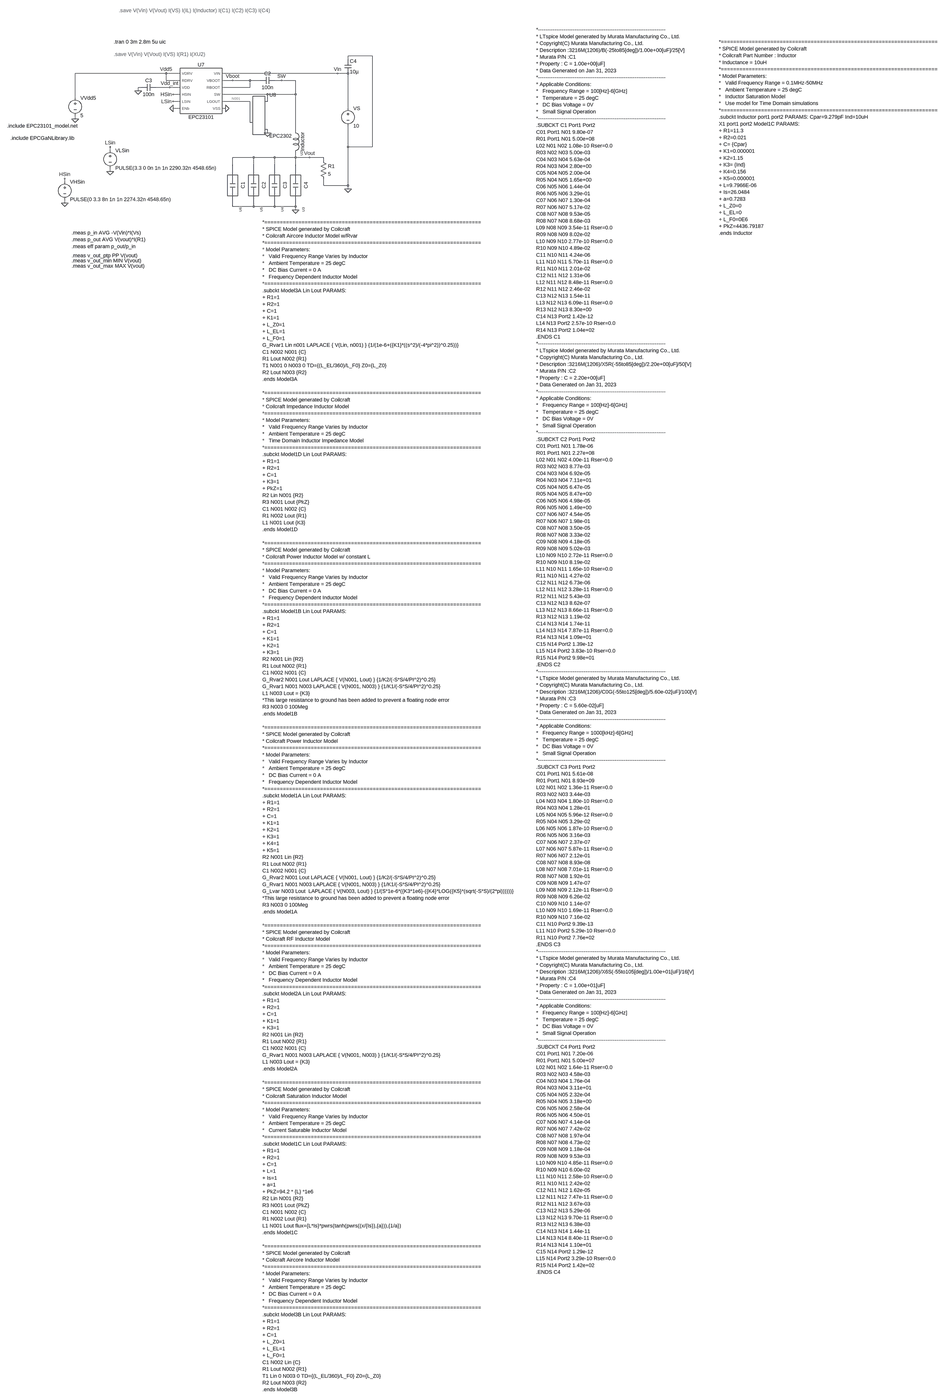
[diagram p0: schematic EPC23101_With_Schottky.asc, whole sheet]
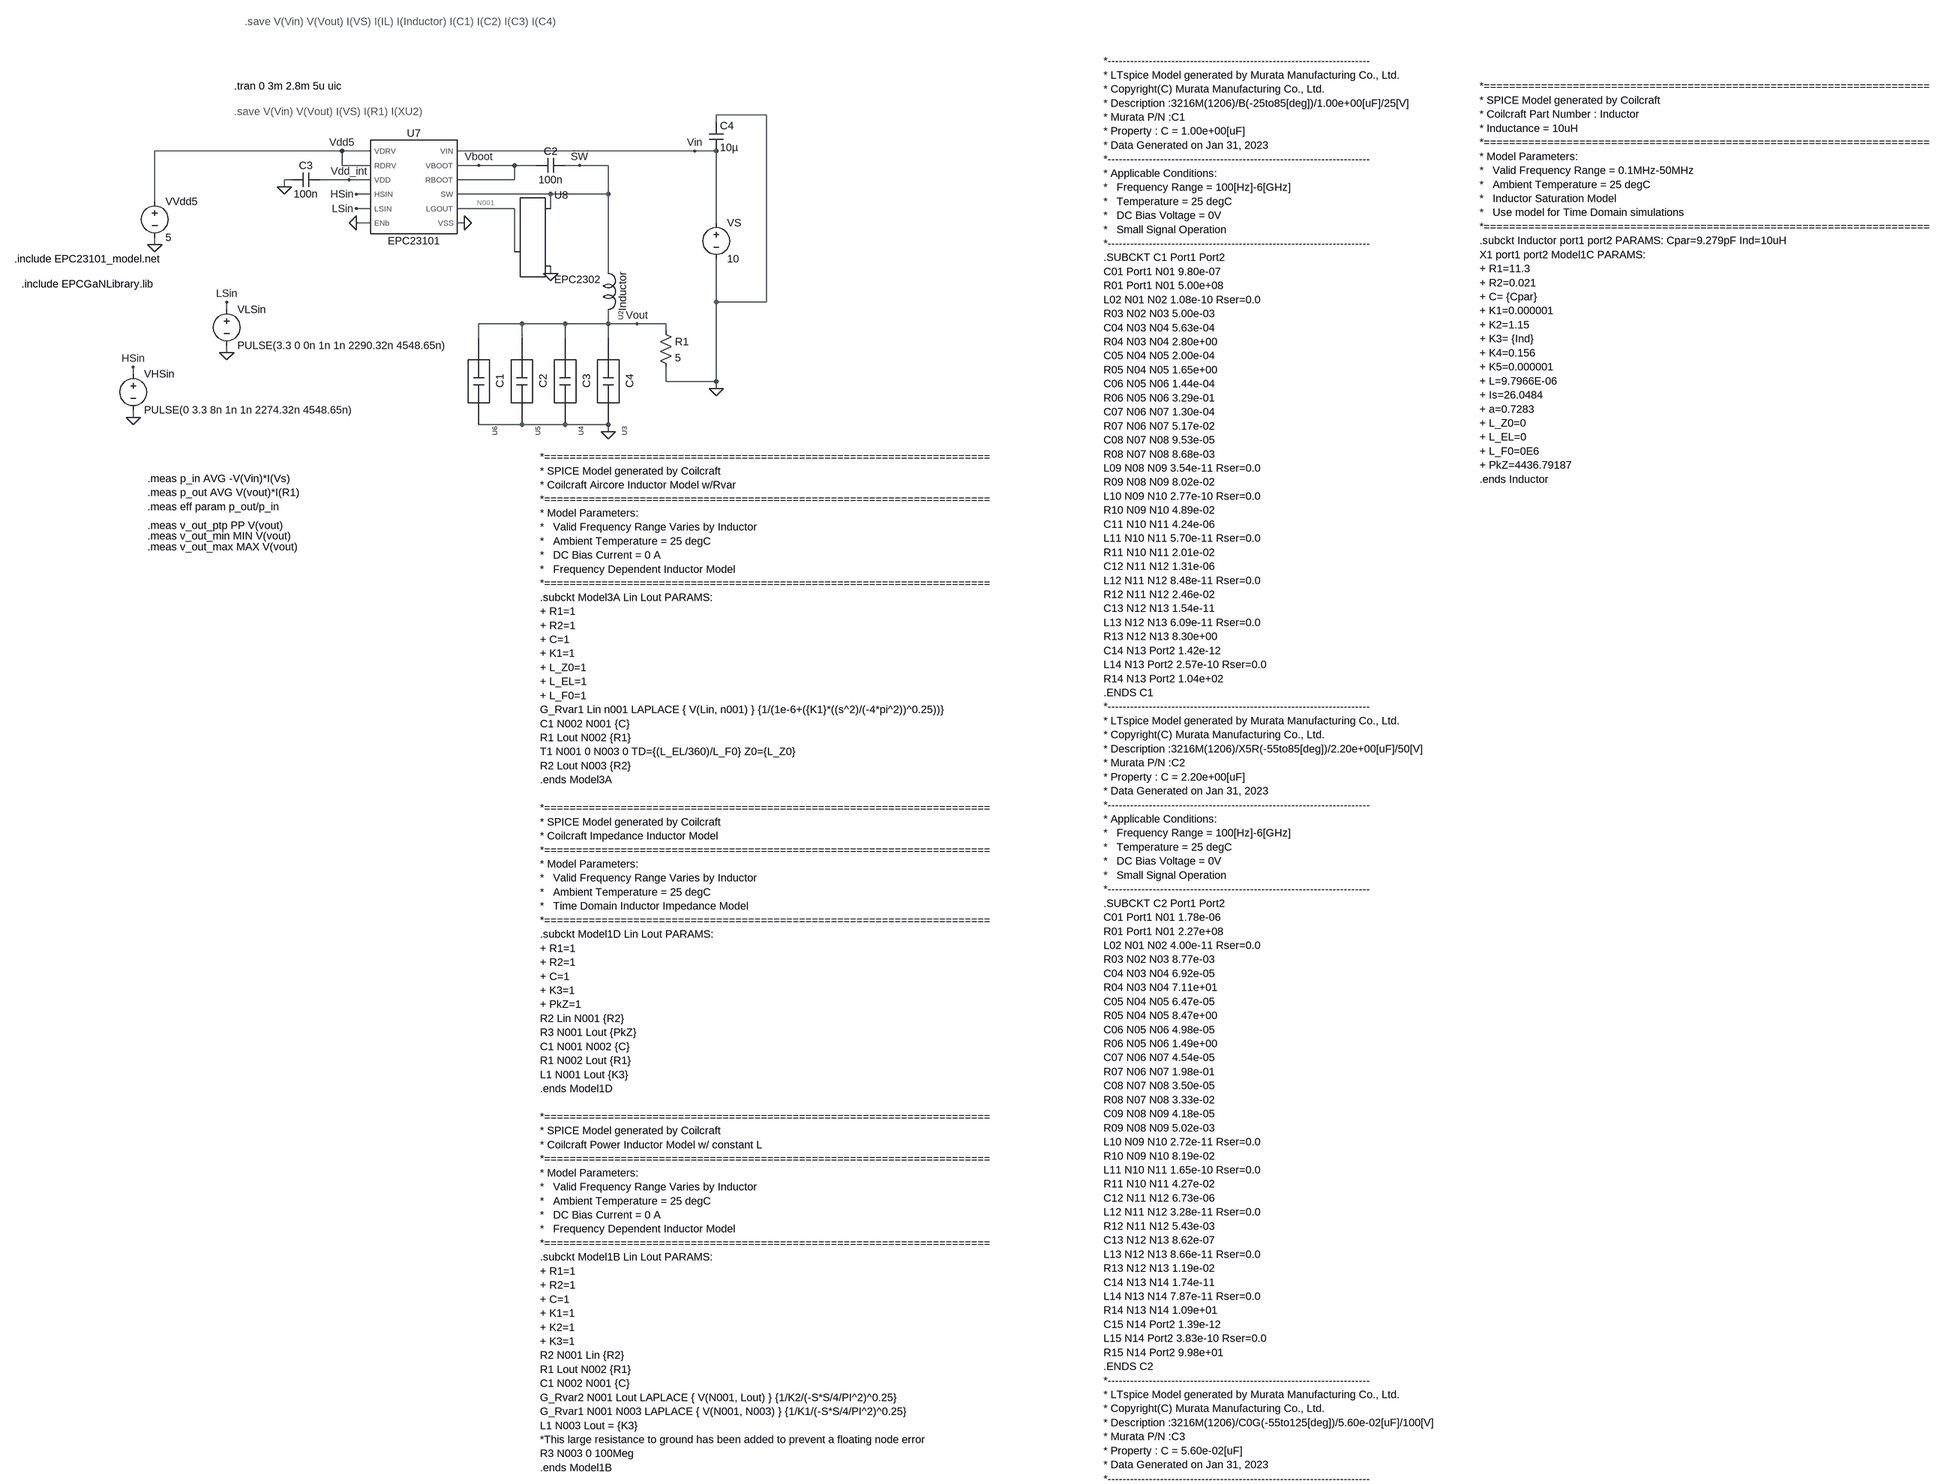
[diagram p1: schematic EPC23101_With_Schottky.asc, part, row 1 of 2, column 1 of 1]
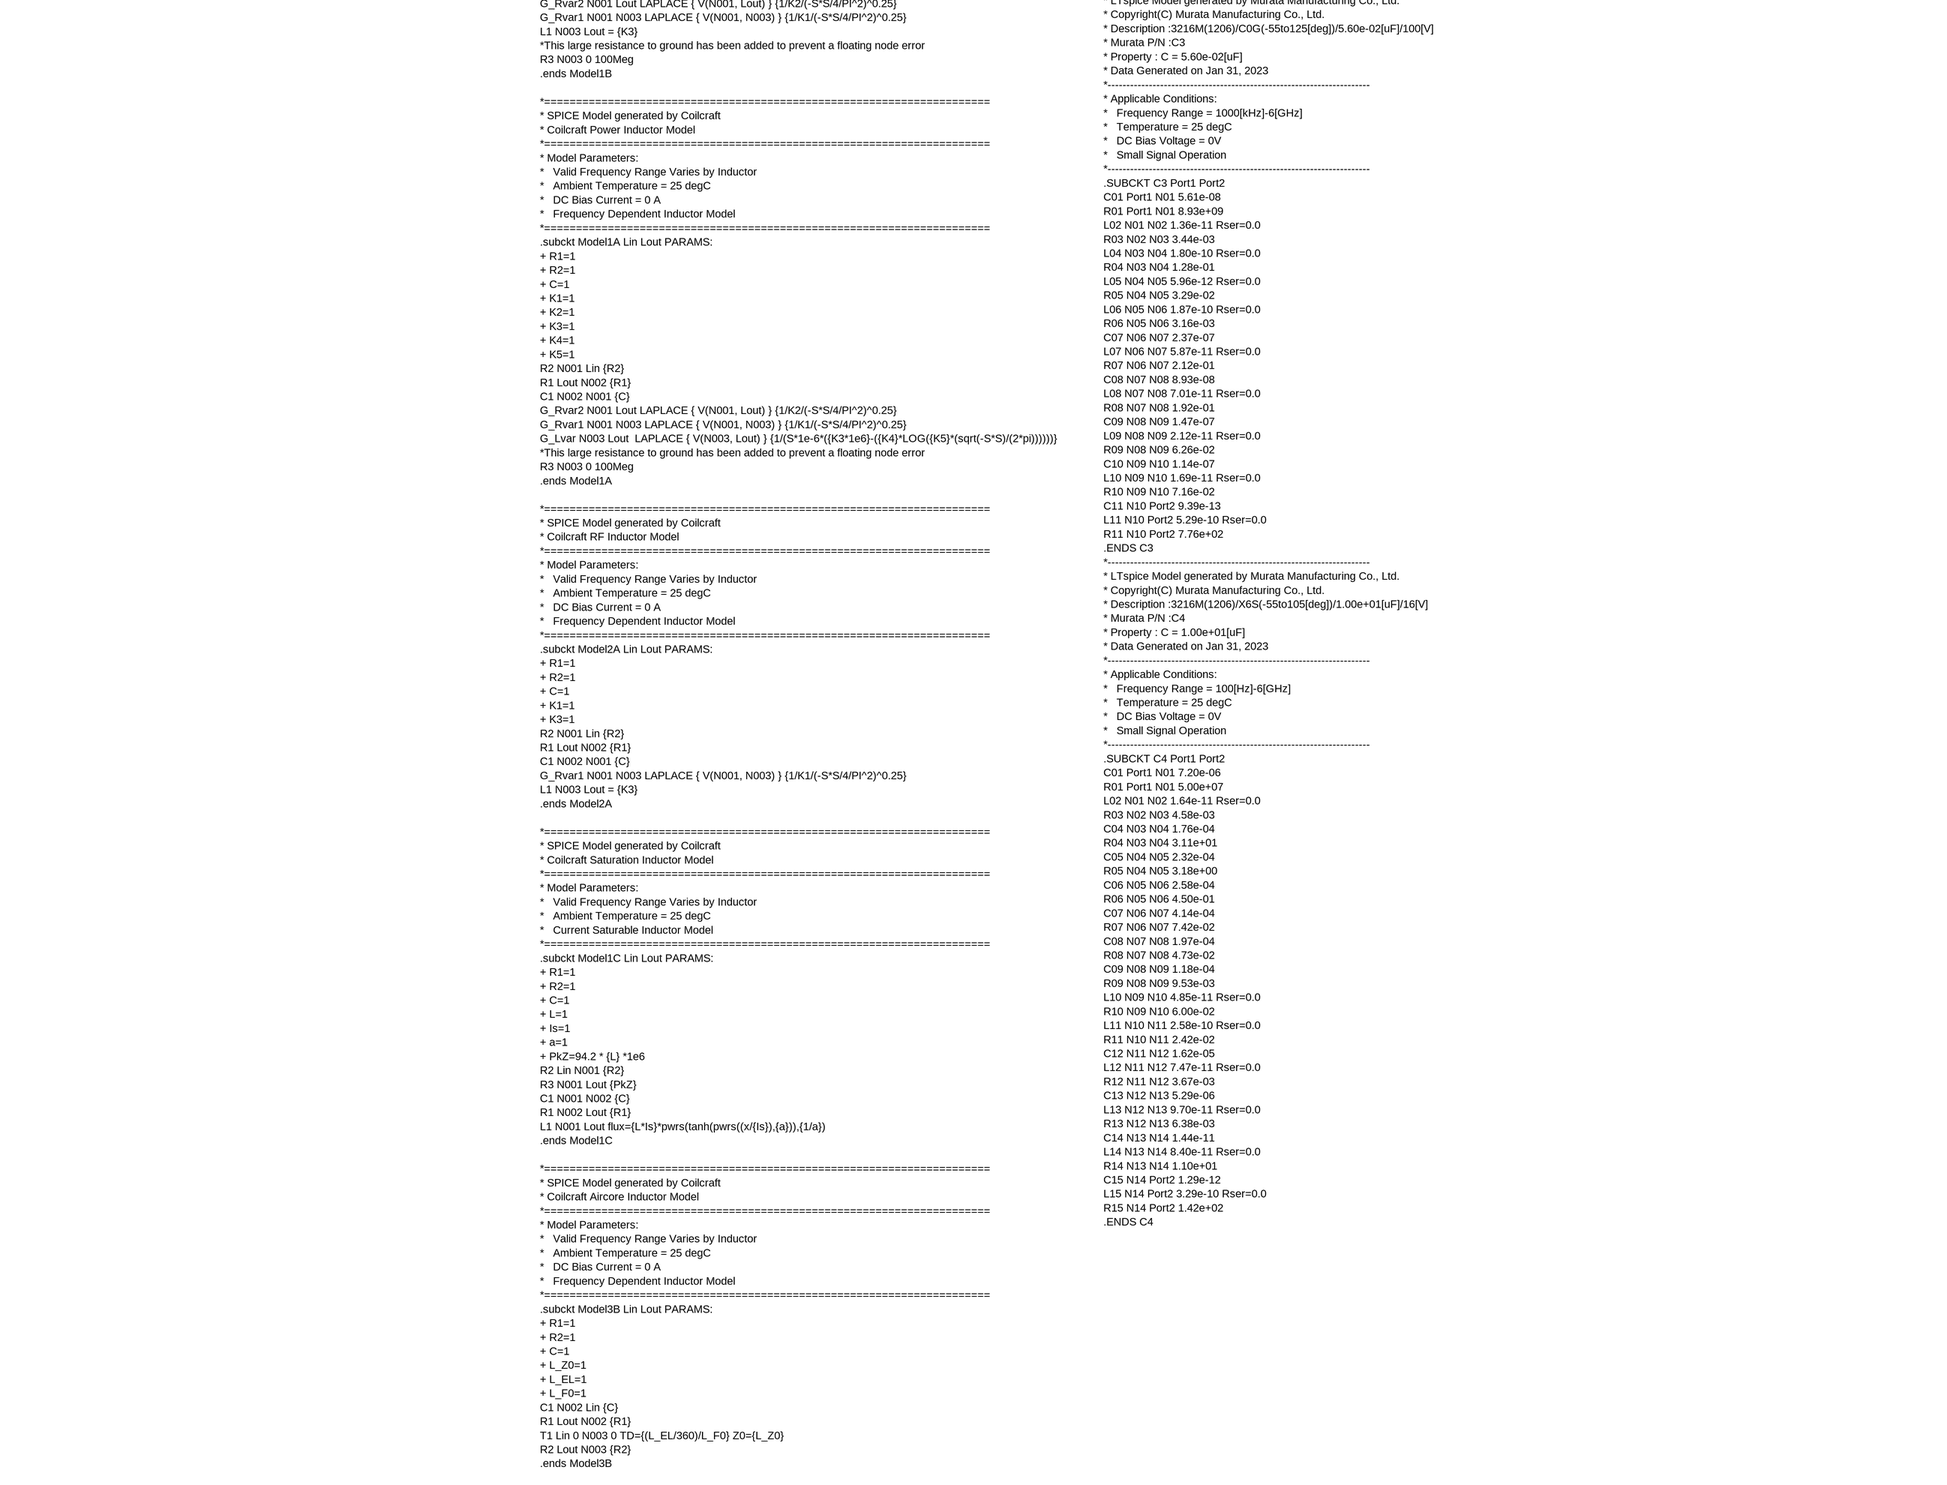
[diagram p2: schematic EPC23101_With_Schottky.asc, part, row 2 of 2, column 1 of 1]
EPC23101_With_Schottky.asc, the LTspice schematic file:
Version 4
SHEET 1 4884 5596
WIRE 1696 -208 1584 -208
WIRE 1584 -192 1584 -208
WIRE 752 -128 336 -128
WIRE 816 -128 752 -128
WIRE 1536 -128 1008 -128
WIRE 1584 -128 1536 -128
WIRE 752 -96 752 -128
WIRE 816 -96 752 -96
WIRE 1056 -96 1008 -96
WIRE 1136 -96 1056 -96
WIRE 1184 -96 1136 -96
WIRE 1280 -96 1248 -96
WIRE 1344 -96 1280 -96
WIRE 640 -64 624 -64
WIRE 768 -64 704 -64
WIRE 816 -64 768 -64
WIRE 1136 -64 1136 -96
WIRE 1136 -64 1008 -64
WIRE 624 -48 624 -64
WIRE 816 -32 784 -32
WIRE 1216 -32 1008 -32
WIRE 1344 -32 1344 -96
WIRE 1344 -32 1216 -32
WIRE 336 -16 336 -128
WIRE 816 0 784 0
WIRE 1136 0 1008 0
WIRE 1216 0 1216 -32
WIRE 816 32 784 32
WIRE 1024 32 1008 32
WIRE 1584 32 1584 -128
WIRE 336 80 336 64
WIRE 1136 96 1136 0
WIRE 1216 144 1216 128
WIRE 1344 144 1344 -32
WIRE 1584 208 1584 112
WIRE 1696 208 1696 -208
WIRE 1696 208 1584 208
WIRE 496 224 496 208
WIRE 1152 256 1056 256
WIRE 1248 256 1152 256
WIRE 1344 256 1344 224
WIRE 1344 256 1248 256
WIRE 1408 256 1344 256
WIRE 1472 256 1408 256
WIRE 1472 272 1472 256
WIRE 1056 288 1056 256
WIRE 1152 288 1152 256
WIRE 1248 288 1248 256
WIRE 1344 288 1344 256
WIRE 496 320 496 304
WIRE 288 368 288 352
WIRE 1472 384 1472 352
WIRE 1584 384 1584 208
WIRE 1584 384 1472 384
WIRE 1584 400 1584 384
WIRE 288 464 288 448
WIRE 1152 480 1056 480
WIRE 1248 480 1152 480
WIRE 1344 480 1248 480
WIRE 1344 496 1344 480
FLAG 1408 256 Vout
FLAG 784 -32 HSin
FLAG 784 0 LSin
FLAG 752 -128 Vdd5
FLAG 1536 -128 Vin
FLAG 1056 -96 Vboot
FLAG 1280 -96 SW
FLAG 768 -64 Vdd_int
FLAG 1024 32 0
FLAG 784 32 0
FLAG 496 208 LSin
FLAG 496 320 0
FLAG 288 352 HSin
FLAG 288 464 0
FLAG 1584 400 0
FLAG 624 -48 0
FLAG 336 80 0
FLAG 1344 496 0
FLAG 1216 144 0
SYMBOL voltage 288 352 R0
WINDOW 123 0 0 Left 0
WINDOW 39 0 0 Left 0
SYMATTR InstName VHSin
SYMATTR Value PULSE(0 3.3 8n 1n 1n 2274.32n 4548.65n)
SYMBOL voltage 496 208 R0
WINDOW 123 0 0 Left 0
WINDOW 39 0 0 Left 0
SYMATTR InstName VLSin
SYMATTR Value PULSE(3.3 0 0n 1n 1n 2290.32n 4548.65n)
SYMBOL cap 1248 -112 R90
WINDOW 0 0 32 VBottom 2
WINDOW 3 32 32 VTop 2
SYMATTR InstName C2
SYMATTR Value 100n
SYMBOL voltage 336 -32 R0
WINDOW 123 0 0 Left 0
WINDOW 39 0 0 Left 0
SYMATTR InstName VVdd5
SYMATTR Value 5
SYMBOL voltage 1584 16 R0
WINDOW 123 0 0 Left 0
WINDOW 39 0 0 Left 0
SYMATTR InstName VS
SYMATTR Value 10
SYMBOL cap 704 -80 R90
WINDOW 0 0 32 VBottom 2
WINDOW 3 32 32 VTop 2
SYMATTR InstName C3
SYMATTR Value 100n
SYMBOL cap 1568 -192 R0
SYMATTR InstName C4
SYMATTR Value 10µ
SYMBOL XAL1010_Mine 1344 144 R90
SYMATTR SpiceModel Inductor
SYMATTR InstName U2
SYMBOL GRM_Mine 1344 384 R90
SYMATTR SpiceModel C4
SYMATTR InstName U3
SYMBOL GRM_Mine 1248 384 R90
SYMATTR SpiceModel C3
SYMATTR InstName U4
SYMBOL GRM_Mine 1152 384 R90
SYMATTR SpiceModel C2
SYMATTR InstName U5
SYMBOL GRM_Mine 1056 384 R90
SYMATTR SpiceModel C1
SYMATTR InstName U6
SYMBOL res 1456 256 R0
SYMATTR InstName R1
SYMATTR Value 5
SYMBOL EPC23101_model 912 -48 R0
SYMATTR InstName U7
SYMBOL EPCGaN 1136 96 R0
SYMATTR InstName U8
SYMATTR Value EPC2302
TEXT 512 -272 Left 2 !.tran 0 3m 2.8m 5u uic
TEXT 512 -216 Left 2 ;.save V(Vin) V(Vout) I(VS) I(R1) I(XU2)
TEXT 1192 552 Left 2 !*======================================================================\n* SPICE Model generated by Coilcraft\n* Coilcraft Aircore Inductor Model w/Rvar\n*======================================================================\n* Model Parameters:\n*   Valid Frequency Range Varies by Inductor\n*   Ambient Temperature = 25 degC\n*   DC Bias Current = 0 A\n*   Frequency Dependent Inductor Model\n*======================================================================\n.subckt Model3A Lin Lout PARAMS:\n+ R1=1\n+ R2=1\n+ C=1\n+ K1=1\n+ L_Z0=1\n+ L_EL=1\n+ L_F0=1\nG_Rvar1 Lin n001 LAPLACE { V(Lin, n001) } {1/(1e-6+({K1}*((s^2)/(-4*pi^2))^0.25))}\nC1 N002 N001 {C}\nR1 Lout N002 {R1}\nT1 N001 0 N003 0 TD={(L_EL/360)/L_F0} Z0={L_Z0}\nR2 Lout N003 {R2}\n.ends Model3A\n \n*======================================================================\n* SPICE Model generated by Coilcraft\n* Coilcraft Impedance Inductor Model\n*======================================================================\n* Model Parameters:\n*   Valid Frequency Range Varies by Inductor\n*   Ambient Temperature = 25 degC\n*   Time Domain Inductor Impedance Model\n*======================================================================\n.subckt Model1D Lin Lout PARAMS:\n+ R1=1\n+ R2=1\n+ C=1\n+ K3=1\n+ PkZ=1\nR2 Lin N001 {R2}\nR3 N001 Lout {PkZ}\nC1 N001 N002 {C}\nR1 N002 Lout {R1}\nL1 N001 Lout {K3}\n.ends Model1D\n \n*======================================================================\n* SPICE Model generated by Coilcraft\n* Coilcraft Power Inductor Model w/ constant L\n*======================================================================\n* Model Parameters:\n*   Valid Frequency Range Varies by Inductor\n*   Ambient Temperature = 25 degC\n*   DC Bias Current = 0 A\n*   Frequency Dependent Inductor Model\n*======================================================================\n.subckt Model1B Lin Lout PARAMS:\n+ R1=1\n+ R2=1\n+ C=1\n+ K1=1\n+ K2=1\n+ K3=1\nR2 N001 Lin {R2}\nR1 Lout N002 {R1}\nC1 N002 N001 {C}\nG_Rvar2 N001 Lout LAPLACE { V(N001, Lout) } {1/K2/(-S*S/4/PI^2)^0.25}\nG_Rvar1 N001 N003 LAPLACE { V(N001, N003) } {1/K1/(-S*S/4/PI^2)^0.25}\nL1 N003 Lout = {K3}\n*This large resistance to ground has been added to prevent a floating node error\nR3 N003 0 100Meg\n.ends Model1B\n \n*======================================================================\n* SPICE Model generated by Coilcraft\n* Coilcraft Power Inductor Model\n*======================================================================\n* Model Parameters:\n*   Valid Frequency Range Varies by Inductor\n*   Ambient Temperature = 25 degC\n*   DC Bias Current = 0 A\n*   Frequency Dependent Inductor Model\n*======================================================================\n.subckt Model1A Lin Lout PARAMS:\n+ R1=1\n+ R2=1\n+ C=1\n+ K1=1\n+ K2=1\n+ K3=1\n+ K4=1\n+ K5=1\nR2 N001 Lin {R2}\nR1 Lout N002 {R1}\nC1 N002 N001 {C}\nG_Rvar2 N001 Lout LAPLACE { V(N001, Lout) } {1/K2/(-S*S/4/PI^2)^0.25}\nG_Rvar1 N001 N003 LAPLACE { V(N001, N003) } {1/K1/(-S*S/4/PI^2)^0.25}\nG_Lvar N003 Lout  LAPLACE { V(N003, Lout) } {1/(S*1e-6*({K3*1e6}-({K4}*LOG({K5}*(sqrt(-S*S)/(2*pi))))))}\n*This large resistance to ground has been added to prevent a floating node error\nR3 N003 0 100Meg\n.ends Model1A\n \n*======================================================================\n* SPICE Model generated by Coilcraft\n* Coilcraft RF Inductor Model\n*======================================================================\n* Model Parameters:\n*   Valid Frequency Range Varies by Inductor\n*   Ambient Temperature = 25 degC\n*   DC Bias Current = 0 A\n*   Frequency Dependent Inductor Model\n*======================================================================\n.subckt Model2A Lin Lout PARAMS:\n+ R1=1\n+ R2=1\n+ C=1\n+ K1=1\n+ K3=1\nR2 N001 Lin {R2}\nR1 Lout N002 {R1}\nC1 N002 N001 {C}\nG_Rvar1 N001 N003 LAPLACE { V(N001, N003) } {1/K1/(-S*S/4/PI^2)^0.25}\nL1 N003 Lout = {K3}\n.ends Model2A\n \n*======================================================================\n* SPICE Model generated by Coilcraft\n* Coilcraft Saturation Inductor Model\n*======================================================================\n* Model Parameters:\n*   Valid Frequency Range Varies by Inductor\n*   Ambient Temperature = 25 degC\n*   Current Saturable Inductor Model\n*======================================================================\n.subckt Model1C Lin Lout PARAMS:\n+ R1=1\n+ R2=1\n+ C=1\n+ L=1\n+ Is=1\n+ a=1\n+ PkZ=94.2 * {L} *1e6\nR2 Lin N001 {R2}\nR3 N001 Lout {PkZ}\nC1 N001 N002 {C}\nR1 N002 Lout {R1}\nL1 N001 Lout flux={L*Is}*pwrs(tanh(pwrs((x/{Is}),{a})),{1/a})\n.ends Model1C\n \n*======================================================================\n* SPICE Model generated by Coilcraft\n* Coilcraft Aircore Inductor Model\n*======================================================================\n* Model Parameters:\n*   Valid Frequency Range Varies by Inductor\n*   Ambient Temperature = 25 degC\n*   DC Bias Current = 0 A\n*   Frequency Dependent Inductor Model\n*======================================================================\n.subckt Model3B Lin Lout PARAMS:\n+ R1=1\n+ R2=1\n+ C=1\n+ L_Z0=1\n+ L_EL=1\n+ L_F0=1\nC1 N002 Lin {C}\nR1 Lout N002 {R1}\nT1 Lin 0 N003 0 TD={(L_EL/360)/L_F0} Z0={L_Z0}\nR2 Lout N003 {R2}\n.ends Model3B
TEXT 536 -416 Left 2 ;.save V(Vin) V(Vout) I(VS) I(IL) I(Inductor) I(C1) I(C2) I(C3) I(C4)
TEXT 320 600 Left 2 !.meas p_in AVG -V(Vin)*I(Vs)\n.meas p_out AVG V(vout)*I(R1)\n.meas eff param p_out/p_in
TEXT 320 704 Left 2 !.meas v_out_ptp PP V(vout)
TEXT 320 728 Left 2 !.meas v_out_min MIN V(vout)
TEXT 320 752 Left 2 !.meas v_out_max MAX V(vout)
TEXT 2560 -328 Left 2 !*----------------------------------------------------------------------\n* LTspice Model generated by Murata Manufacturing Co., Ltd.\n* Copyright(C) Murata Manufacturing Co., Ltd.\n* Description :3216M(1206)/B(-25to85[deg])/1.00e+00[uF]/25[V]\n* Murata P/N :C1\n* Property : C = 1.00e+00[uF]\n* Data Generated on Jan 31, 2023\n*----------------------------------------------------------------------\n* Applicable Conditions:\n*   Frequency Range = 100[Hz]-6[GHz]\n*   Temperature = 25 degC\n*   DC Bias Voltage = 0V\n*   Small Signal Operation\n*----------------------------------------------------------------------\n.SUBCKT C1 Port1 Port2\nC01 Port1 N01 9.80e-07\nR01 Port1 N01 5.00e+08\nL02 N01 N02 1.08e-10 Rser=0.0\nR03 N02 N03 5.00e-03\nC04 N03 N04 5.63e-04\nR04 N03 N04 2.80e+00\nC05 N04 N05 2.00e-04\nR05 N04 N05 1.65e+00\nC06 N05 N06 1.44e-04\nR06 N05 N06 3.29e-01\nC07 N06 N07 1.30e-04\nR07 N06 N07 5.17e-02\nC08 N07 N08 9.53e-05\nR08 N07 N08 8.68e-03\nL09 N08 N09 3.54e-11 Rser=0.0\nR09 N08 N09 8.02e-02\nL10 N09 N10 2.77e-10 Rser=0.0\nR10 N09 N10 4.89e-02\nC11 N10 N11 4.24e-06\nL11 N10 N11 5.70e-11 Rser=0.0\nR11 N10 N11 2.01e-02\nC12 N11 N12 1.31e-06\nL12 N11 N12 8.48e-11 Rser=0.0\nR12 N11 N12 2.46e-02\nC13 N12 N13 1.54e-11\nL13 N12 N13 6.09e-11 Rser=0.0\nR13 N12 N13 8.30e+00\nC14 N13 Port2 1.42e-12\nL14 N13 Port2 2.57e-10 Rser=0.0\nR14 N13 Port2 1.04e+02\n.ENDS C1\n*----------------------------------------------------------------------\n* LTspice Model generated by Murata Manufacturing Co., Ltd.\n* Copyright(C) Murata Manufacturing Co., Ltd.\n* Description :3216M(1206)/X5R(-55to85[deg])/2.20e+00[uF]/50[V]\n* Murata P/N :C2\n* Property : C = 2.20e+00[uF]\n* Data Generated on Jan 31, 2023\n*----------------------------------------------------------------------\n* Applicable Conditions:\n*   Frequency Range = 100[Hz]-6[GHz]\n*   Temperature = 25 degC\n*   DC Bias Voltage = 0V\n*   Small Signal Operation\n*----------------------------------------------------------------------\n.SUBCKT C2 Port1 Port2\nC01 Port1 N01 1.78e-06\nR01 Port1 N01 2.27e+08\nL02 N01 N02 4.00e-11 Rser=0.0\nR03 N02 N03 8.77e-03\nC04 N03 N04 6.92e-05\nR04 N03 N04 7.11e+01\nC05 N04 N05 6.47e-05\nR05 N04 N05 8.47e+00\nC06 N05 N06 4.98e-05\nR06 N05 N06 1.49e+00\nC07 N06 N07 4.54e-05\nR07 N06 N07 1.98e-01\nC08 N07 N08 3.50e-05\nR08 N07 N08 3.33e-02\nC09 N08 N09 4.18e-05\nR09 N08 N09 5.02e-03\nL10 N09 N10 2.72e-11 Rser=0.0\nR10 N09 N10 8.19e-02\nL11 N10 N11 1.65e-10 Rser=0.0\nR11 N10 N11 4.27e-02\nC12 N11 N12 6.73e-06\nL12 N11 N12 3.28e-11 Rser=0.0\nR12 N11 N12 5.43e-03\nC13 N12 N13 8.62e-07\nL13 N12 N13 8.66e-11 Rser=0.0\nR13 N12 N13 1.19e-02\nC14 N13 N14 1.74e-11\nL14 N13 N14 7.87e-11 Rser=0.0\nR14 N13 N14 1.09e+01\nC15 N14 Port2 1.39e-12\nL15 N14 Port2 3.83e-10 Rser=0.0\nR15 N14 Port2 9.98e+01\n.ENDS C2\n*----------------------------------------------------------------------\n* LTspice Model generated by Murata Manufacturing Co., Ltd.\n* Copyright(C) Murata Manufacturing Co., Ltd.\n* Description :3216M(1206)/C0G(-55to125[deg])/5.60e-02[uF]/100[V]\n* Murata P/N :C3\n* Property : C = 5.60e-02[uF]\n* Data Generated on Jan 31, 2023\n*----------------------------------------------------------------------\n* Applicable Conditions:\n*   Frequency Range = 1000[kHz]-6[GHz]\n*   Temperature = 25 degC\n*   DC Bias Voltage = 0V\n*   Small Signal Operation\n*----------------------------------------------------------------------\n.SUBCKT C3 Port1 Port2\nC01 Port1 N01 5.61e-08\nR01 Port1 N01 8.93e+09\nL02 N01 N02 1.36e-11 Rser=0.0\nR03 N02 N03 3.44e-03\nL04 N03 N04 1.80e-10 Rser=0.0\nR04 N03 N04 1.28e-01\nL05 N04 N05 5.96e-12 Rser=0.0\nR05 N04 N05 3.29e-02\nL06 N05 N06 1.87e-10 Rser=0.0\nR06 N05 N06 3.16e-03\nC07 N06 N07 2.37e-07\nL07 N06 N07 5.87e-11 Rser=0.0\nR07 N06 N07 2.12e-01\nC08 N07 N08 8.93e-08\nL08 N07 N08 7.01e-11 Rser=0.0\nR08 N07 N08 1.92e-01\nC09 N08 N09 1.47e-07\nL09 N08 N09 2.12e-11 Rser=0.0\nR09 N08 N09 6.26e-02\nC10 N09 N10 1.14e-07\nL10 N09 N10 1.69e-11 Rser=0.0\nR10 N09 N10 7.16e-02\nC11 N10 Port2 9.39e-13\nL11 N10 Port2 5.29e-10 Rser=0.0\nR11 N10 Port2 7.76e+02\n.ENDS C3\n*----------------------------------------------------------------------\n* LTspice Model generated by Murata Manufacturing Co., Ltd.\n* Copyright(C) Murata Manufacturing Co., Ltd.\n* Description :3216M(1206)/X6S(-55to105[deg])/1.00e+01[uF]/16[V]\n* Murata P/N :C4\n* Property : C = 1.00e+01[uF]\n* Data Generated on Jan 31, 2023\n*----------------------------------------------------------------------\n* Applicable Conditions:\n*   Frequency Range = 100[Hz]-6[GHz]\n*   Temperature = 25 degC\n*   DC Bias Voltage = 0V\n*   Small Signal Operation\n*----------------------------------------------------------------------\n.SUBCKT C4 Port1 Port2\nC01 Port1 N01 7.20e-06\nR01 Port1 N01 5.00e+07\nL02 N01 N02 1.64e-11 Rser=0.0\nR03 N02 N03 4.58e-03\nC04 N03 N04 1.76e-04\nR04 N03 N04 3.11e+01\nC05 N04 N05 2.32e-04\nR05 N04 N05 3.18e+00\nC06 N05 N06 2.58e-04\nR06 N05 N06 4.50e-01\nC07 N06 N07 4.14e-04\nR07 N06 N07 7.42e-02\nC08 N07 N08 1.97e-04\nR08 N07 N08 4.73e-02\nC09 N08 N09 1.18e-04\nR09 N08 N09 9.53e-03\nL10 N09 N10 4.85e-11 Rser=0.0\nR10 N09 N10 6.00e-02\nL11 N10 N11 2.58e-10 Rser=0.0\nR11 N10 N11 2.42e-02\nC12 N11 N12 1.62e-05\nL12 N11 N12 7.47e-11 Rser=0.0\nR12 N11 N12 3.67e-03\nC13 N12 N13 5.29e-06\nL13 N12 N13 9.70e-11 Rser=0.0\nR13 N12 N13 6.38e-03\nC14 N13 N14 1.44e-11\nL14 N13 N14 8.40e-11 Rser=0.0\nR14 N13 N14 1.10e+01\nC15 N14 Port2 1.29e-12\nL15 N14 Port2 3.29e-10 Rser=0.0\nR15 N14 Port2 1.42e+02\n.ENDS C4
TEXT 3576 -272 Left 2 !*======================================================================\n* SPICE Model generated by Coilcraft\n* Coilcraft Part Number : Inductor\n* Inductance = 10uH\n*======================================================================\n* Model Parameters:\n*   Valid Frequency Range = 0.1MHz-50MHz\n*   Ambient Temperature = 25 degC\n*   Inductor Saturation Model\n*   Use model for Time Domain simulations\n*======================================================================\n.subckt Inductor port1 port2 PARAMS: Cpar=9.279pF Ind=10uH\nX1 port1 port2 Model1C PARAMS:\n+ R1=11.3\n+ R2=0.021\n+ C= {Cpar}\n+ K1=0.000001\n+ K2=1.15\n+ K3= {Ind}\n+ K4=0.156\n+ K5=0.000001\n+ L=9.7966E-06\n+ Is=26.0484\n+ a=0.7283\n+ L_Z0=0\n+ L_EL=0\n+ L_F0=0E6\n+ PkZ=4436.79187\n.ends Inductor
TEXT 24 112 Left 2 !.include EPC23101_model.net
TEXT 40 168 Left 2 !.include EPCGaNLibrary.lib

The netlist it stands for:
* EPC23101_With_Schottky.asc
VHSin HSin 0 PULSE(0 3.3 8n 1n 1n 2274.32n 4548.65n)
VLSin LSin 0 PULSE(3.3 0 0n 1n 1n 2290.32n 4548.65n)
C2 SW Vboot 100n
VVdd5 Vdd5 0 5
VS Vin 0 10
C3 Vdd_int 0 100n
C4 0 Vin 10µ
XU2 SW Vout Inductor  ; pins port1 port2
XU3 Vout 0 C4  ; pins port1 port2
XU4 Vout 0 C3  ; pins port1 port2
XU5 Vout 0 C2  ; pins port1 port2
XU6 Vout 0 C1  ; pins port1 port2
R1 Vout 0 5
XU7 0 HSin LSin Vdd5 0 N001 Vboot Vdd5 SW Vboot Vdd_int Vin EPC23101  ; pins ENb HSIN LSIN VDRV VSS LGOUT RBOOT RDRV SW VBOOT VDD VIN
XU8 N001 SW 0 EPC2302
.tran 0 3m 2.8m 5u uic
* .save V(Vin) V(Vout) I(VS) I(R1) I(XU2)
*======================================================================
* SPICE Model generated by Coilcraft
* Coilcraft Aircore Inductor Model w/Rvar
*======================================================================
* Model Parameters:
*   Valid Frequency Range Varies by Inductor
*   Ambient Temperature = 25 degC
*   DC Bias Current = 0 A
*   Frequency Dependent Inductor Model
*======================================================================
.subckt Model3A Lin Lout PARAMS:
+ R1=1
+ R2=1
+ C=1
+ K1=1
+ L_Z0=1
+ L_EL=1
+ L_F0=1
G_Rvar1 Lin n001 LAPLACE { V(Lin, n001) } {1/(1e-6+({K1}*((s^2)/(-4*pi^2))^0.25))}
C1 N002 N001 {C}
R1 Lout N002 {R1}
T1 N001 0 N003 0 TD={(L_EL/360)/L_F0} Z0={L_Z0}
R2 Lout N003 {R2}
.ends Model3A
*======================================================================
* SPICE Model generated by Coilcraft
* Coilcraft Impedance Inductor Model
*======================================================================
* Model Parameters:
*   Valid Frequency Range Varies by Inductor
*   Ambient Temperature = 25 degC
*   Time Domain Inductor Impedance Model
*======================================================================
.subckt Model1D Lin Lout PARAMS:
+ R1=1
+ R2=1
+ C=1
+ K3=1
+ PkZ=1
R2 Lin N001 {R2}
R3 N001 Lout {PkZ}
C1 N001 N002 {C}
R1 N002 Lout {R1}
L1 N001 Lout {K3}
.ends Model1D
*======================================================================
* SPICE Model generated by Coilcraft
* Coilcraft Power Inductor Model w/ constant L
*======================================================================
* Model Parameters:
*   Valid Frequency Range Varies by Inductor
*   Ambient Temperature = 25 degC
*   DC Bias Current = 0 A
*   Frequency Dependent Inductor Model
*======================================================================
.subckt Model1B Lin Lout PARAMS:
+ R1=1
+ R2=1
+ C=1
+ K1=1
+ K2=1
+ K3=1
R2 N001 Lin {R2}
R1 Lout N002 {R1}
C1 N002 N001 {C}
G_Rvar2 N001 Lout LAPLACE { V(N001, Lout) } {1/K2/(-S*S/4/PI^2)^0.25}
G_Rvar1 N001 N003 LAPLACE { V(N001, N003) } {1/K1/(-S*S/4/PI^2)^0.25}
L1 N003 Lout = {K3}
*This large resistance to ground has been added to prevent a floating node error
R3 N003 0 100Meg
.ends Model1B
*======================================================================
* SPICE Model generated by Coilcraft
* Coilcraft Power Inductor Model
*======================================================================
* Model Parameters:
*   Valid Frequency Range Varies by Inductor
*   Ambient Temperature = 25 degC
*   DC Bias Current = 0 A
*   Frequency Dependent Inductor Model
*======================================================================
.subckt Model1A Lin Lout PARAMS:
+ R1=1
+ R2=1
+ C=1
+ K1=1
+ K2=1
+ K3=1
+ K4=1
+ K5=1
R2 N001 Lin {R2}
R1 Lout N002 {R1}
C1 N002 N001 {C}
G_Rvar2 N001 Lout LAPLACE { V(N001, Lout) } {1/K2/(-S*S/4/PI^2)^0.25}
G_Rvar1 N001 N003 LAPLACE { V(N001, N003) } {1/K1/(-S*S/4/PI^2)^0.25}
G_Lvar N003 Lout  LAPLACE { V(N003, Lout) } {1/(S*1e-6*({K3*1e6}-({K4}*LOG({K5}*(sqrt(-S*S)/(2*pi))))))}
*This large resistance to ground has been added to prevent a floating node error
R3 N003 0 100Meg
.ends Model1A
*======================================================================
* SPICE Model generated by Coilcraft
* Coilcraft RF Inductor Model
*======================================================================
* Model Parameters:
*   Valid Frequency Range Varies by Inductor
*   Ambient Temperature = 25 degC
*   DC Bias Current = 0 A
*   Frequency Dependent Inductor Model
*======================================================================
.subckt Model2A Lin Lout PARAMS:
+ R1=1
+ R2=1
+ C=1
+ K1=1
+ K3=1
R2 N001 Lin {R2}
R1 Lout N002 {R1}
C1 N002 N001 {C}
G_Rvar1 N001 N003 LAPLACE { V(N001, N003) } {1/K1/(-S*S/4/PI^2)^0.25}
L1 N003 Lout = {K3}
.ends Model2A
*======================================================================
* SPICE Model generated by Coilcraft
* Coilcraft Saturation Inductor Model
*======================================================================
* Model Parameters:
*   Valid Frequency Range Varies by Inductor
*   Ambient Temperature = 25 degC
*   Current Saturable Inductor Model
*======================================================================
.subckt Model1C Lin Lout PARAMS:
+ R1=1
+ R2=1
+ C=1
+ L=1
+ Is=1
+ a=1
+ PkZ=94.2 * {L} *1e6
R2 Lin N001 {R2}
R3 N001 Lout {PkZ}
C1 N001 N002 {C}
R1 N002 Lout {R1}
L1 N001 Lout flux={L*Is}*pwrs(tanh(pwrs((x/{Is}),{a})),{1/a})
.ends Model1C
*======================================================================
* SPICE Model generated by Coilcraft
* Coilcraft Aircore Inductor Model
*======================================================================
* Model Parameters:
*   Valid Frequency Range Varies by Inductor
*   Ambient Temperature = 25 degC
*   DC Bias Current = 0 A
*   Frequency Dependent Inductor Model
*======================================================================
.subckt Model3B Lin Lout PARAMS:
+ R1=1
+ R2=1
+ C=1
+ L_Z0=1
+ L_EL=1
+ L_F0=1
C1 N002 Lin {C}
R1 Lout N002 {R1}
T1 Lin 0 N003 0 TD={(L_EL/360)/L_F0} Z0={L_Z0}
R2 Lout N003 {R2}
.ends Model3B
* .save V(Vin) V(Vout) I(VS) I(IL) I(Inductor) I(C1) I(C2) I(C3) I(C4)
.meas p_in AVG -V(Vin)*I(Vs)
.meas p_out AVG V(vout)*I(R1)
.meas eff param p_out/p_in
.meas v_out_ptp PP V(vout)
.meas v_out_min MIN V(vout)
.meas v_out_max MAX V(vout)
*----------------------------------------------------------------------
* LTspice Model generated by Murata Manufacturing Co., Ltd.
* Copyright(C) Murata Manufacturing Co., Ltd.
* Description :3216M(1206)/B(-25to85[deg])/1.00e+00[uF]/25[V]
* Murata P/N :C1
* Property : C = 1.00e+00[uF]
* Data Generated on Jan 31, 2023
*----------------------------------------------------------------------
* Applicable Conditions:
*   Frequency Range = 100[Hz]-6[GHz]
*   Temperature = 25 degC
*   DC Bias Voltage = 0V
*   Small Signal Operation
*----------------------------------------------------------------------
.SUBCKT C1 Port1 Port2
C01 Port1 N01 9.80e-07
R01 Port1 N01 5.00e+08
L02 N01 N02 1.08e-10 Rser=0.0
R03 N02 N03 5.00e-03
C04 N03 N04 5.63e-04
R04 N03 N04 2.80e+00
C05 N04 N05 2.00e-04
R05 N04 N05 1.65e+00
C06 N05 N06 1.44e-04
R06 N05 N06 3.29e-01
C07 N06 N07 1.30e-04
R07 N06 N07 5.17e-02
C08 N07 N08 9.53e-05
R08 N07 N08 8.68e-03
L09 N08 N09 3.54e-11 Rser=0.0
R09 N08 N09 8.02e-02
L10 N09 N10 2.77e-10 Rser=0.0
R10 N09 N10 4.89e-02
C11 N10 N11 4.24e-06
L11 N10 N11 5.70e-11 Rser=0.0
R11 N10 N11 2.01e-02
C12 N11 N12 1.31e-06
L12 N11 N12 8.48e-11 Rser=0.0
R12 N11 N12 2.46e-02
C13 N12 N13 1.54e-11
L13 N12 N13 6.09e-11 Rser=0.0
R13 N12 N13 8.30e+00
C14 N13 Port2 1.42e-12
L14 N13 Port2 2.57e-10 Rser=0.0
R14 N13 Port2 1.04e+02
.ENDS C1
*----------------------------------------------------------------------
* LTspice Model generated by Murata Manufacturing Co., Ltd.
* Copyright(C) Murata Manufacturing Co., Ltd.
* Description :3216M(1206)/X5R(-55to85[deg])/2.20e+00[uF]/50[V]
* Murata P/N :C2
* Property : C = 2.20e+00[uF]
* Data Generated on Jan 31, 2023
*----------------------------------------------------------------------
* Applicable Conditions:
*   Frequency Range = 100[Hz]-6[GHz]
*   Temperature = 25 degC
*   DC Bias Voltage = 0V
*   Small Signal Operation
*----------------------------------------------------------------------
.SUBCKT C2 Port1 Port2
C01 Port1 N01 1.78e-06
R01 Port1 N01 2.27e+08
L02 N01 N02 4.00e-11 Rser=0.0
R03 N02 N03 8.77e-03
C04 N03 N04 6.92e-05
R04 N03 N04 7.11e+01
C05 N04 N05 6.47e-05
R05 N04 N05 8.47e+00
C06 N05 N06 4.98e-05
R06 N05 N06 1.49e+00
C07 N06 N07 4.54e-05
R07 N06 N07 1.98e-01
C08 N07 N08 3.50e-05
R08 N07 N08 3.33e-02
C09 N08 N09 4.18e-05
R09 N08 N09 5.02e-03
L10 N09 N10 2.72e-11 Rser=0.0
R10 N09 N10 8.19e-02
L11 N10 N11 1.65e-10 Rser=0.0
R11 N10 N11 4.27e-02
C12 N11 N12 6.73e-06
L12 N11 N12 3.28e-11 Rser=0.0
R12 N11 N12 5.43e-03
C13 N12 N13 8.62e-07
L13 N12 N13 8.66e-11 Rser=0.0
R13 N12 N13 1.19e-02
C14 N13 N14 1.74e-11
L14 N13 N14 7.87e-11 Rser=0.0
R14 N13 N14 1.09e+01
C15 N14 Port2 1.39e-12
L15 N14 Port2 3.83e-10 Rser=0.0
R15 N14 Port2 9.98e+01
.ENDS C2
*----------------------------------------------------------------------
* LTspice Model generated by Murata Manufacturing Co., Ltd.
* Copyright(C) Murata Manufacturing Co., Ltd.
* Description :3216M(1206)/C0G(-55to125[deg])/5.60e-02[uF]/100[V]
* Murata P/N :C3
* Property : C = 5.60e-02[uF]
* Data Generated on Jan 31, 2023
*----------------------------------------------------------------------
* Applicable Conditions:
*   Frequency Range = 1000[kHz]-6[GHz]
*   Temperature = 25 degC
*   DC Bias Voltage = 0V
*   Small Signal Operation
*----------------------------------------------------------------------
.SUBCKT C3 Port1 Port2
C01 Port1 N01 5.61e-08
R01 Port1 N01 8.93e+09
L02 N01 N02 1.36e-11 Rser=0.0
R03 N02 N03 3.44e-03
L04 N03 N04 1.80e-10 Rser=0.0
R04 N03 N04 1.28e-01
L05 N04 N05 5.96e-12 Rser=0.0
R05 N04 N05 3.29e-02
L06 N05 N06 1.87e-10 Rser=0.0
R06 N05 N06 3.16e-03
C07 N06 N07 2.37e-07
L07 N06 N07 5.87e-11 Rser=0.0
R07 N06 N07 2.12e-01
C08 N07 N08 8.93e-08
L08 N07 N08 7.01e-11 Rser=0.0
R08 N07 N08 1.92e-01
C09 N08 N09 1.47e-07
L09 N08 N09 2.12e-11 Rser=0.0
R09 N08 N09 6.26e-02
C10 N09 N10 1.14e-07
L10 N09 N10 1.69e-11 Rser=0.0
R10 N09 N10 7.16e-02
C11 N10 Port2 9.39e-13
L11 N10 Port2 5.29e-10 Rser=0.0
R11 N10 Port2 7.76e+02
.ENDS C3
*----------------------------------------------------------------------
* LTspice Model generated by Murata Manufacturing Co., Ltd.
* Copyright(C) Murata Manufacturing Co., Ltd.
* Description :3216M(1206)/X6S(-55to105[deg])/1.00e+01[uF]/16[V]
* Murata P/N :C4
* Property : C = 1.00e+01[uF]
* Data Generated on Jan 31, 2023
*----------------------------------------------------------------------
* Applicable Conditions:
*   Frequency Range = 100[Hz]-6[GHz]
*   Temperature = 25 degC
*   DC Bias Voltage = 0V
*   Small Signal Operation
*----------------------------------------------------------------------
.SUBCKT C4 Port1 Port2
C01 Port1 N01 7.20e-06
R01 Port1 N01 5.00e+07
L02 N01 N02 1.64e-11 Rser=0.0
R03 N02 N03 4.58e-03
C04 N03 N04 1.76e-04
R04 N03 N04 3.11e+01
C05 N04 N05 2.32e-04
R05 N04 N05 3.18e+00
C06 N05 N06 2.58e-04
R06 N05 N06 4.50e-01
C07 N06 N07 4.14e-04
R07 N06 N07 7.42e-02
C08 N07 N08 1.97e-04
R08 N07 N08 4.73e-02
C09 N08 N09 1.18e-04
R09 N08 N09 9.53e-03
L10 N09 N10 4.85e-11 Rser=0.0
R10 N09 N10 6.00e-02
L11 N10 N11 2.58e-10 Rser=0.0
R11 N10 N11 2.42e-02
C12 N11 N12 1.62e-05
L12 N11 N12 7.47e-11 Rser=0.0
R12 N11 N12 3.67e-03
C13 N12 N13 5.29e-06
L13 N12 N13 9.70e-11 Rser=0.0
R13 N12 N13 6.38e-03
C14 N13 N14 1.44e-11
L14 N13 N14 8.40e-11 Rser=0.0
R14 N13 N14 1.10e+01
C15 N14 Port2 1.29e-12
L15 N14 Port2 3.29e-10 Rser=0.0
R15 N14 Port2 1.42e+02
.ENDS C4
*======================================================================
* SPICE Model generated by Coilcraft
* Coilcraft Part Number : Inductor
* Inductance = 10uH
*======================================================================
* Model Parameters:
*   Valid Frequency Range = 0.1MHz-50MHz
*   Ambient Temperature = 25 degC
*   Inductor Saturation Model
*   Use model for Time Domain simulations
*======================================================================
.subckt Inductor port1 port2 PARAMS: Cpar=9.279pF Ind=10uH
X1 port1 port2 Model1C PARAMS:
+ R1=11.3
+ R2=0.021
+ C= {Cpar}
+ K1=0.000001
+ K2=1.15
+ K3= {Ind}
+ K4=0.156
+ K5=0.000001
+ L=9.7966E-06
+ Is=26.0484
+ a=0.7283
+ L_Z0=0
+ L_EL=0
+ L_F0=0E6
+ PkZ=4436.79187
.ends Inductor
.include EPC23101_model.net
.include EPCGaNLibrary.lib
.backanno
.end